# Altium schematic sheet Array-Sensors.SchDoc
size 420 x 297 mm; SheetNumber: 1; SheetTotal: 1
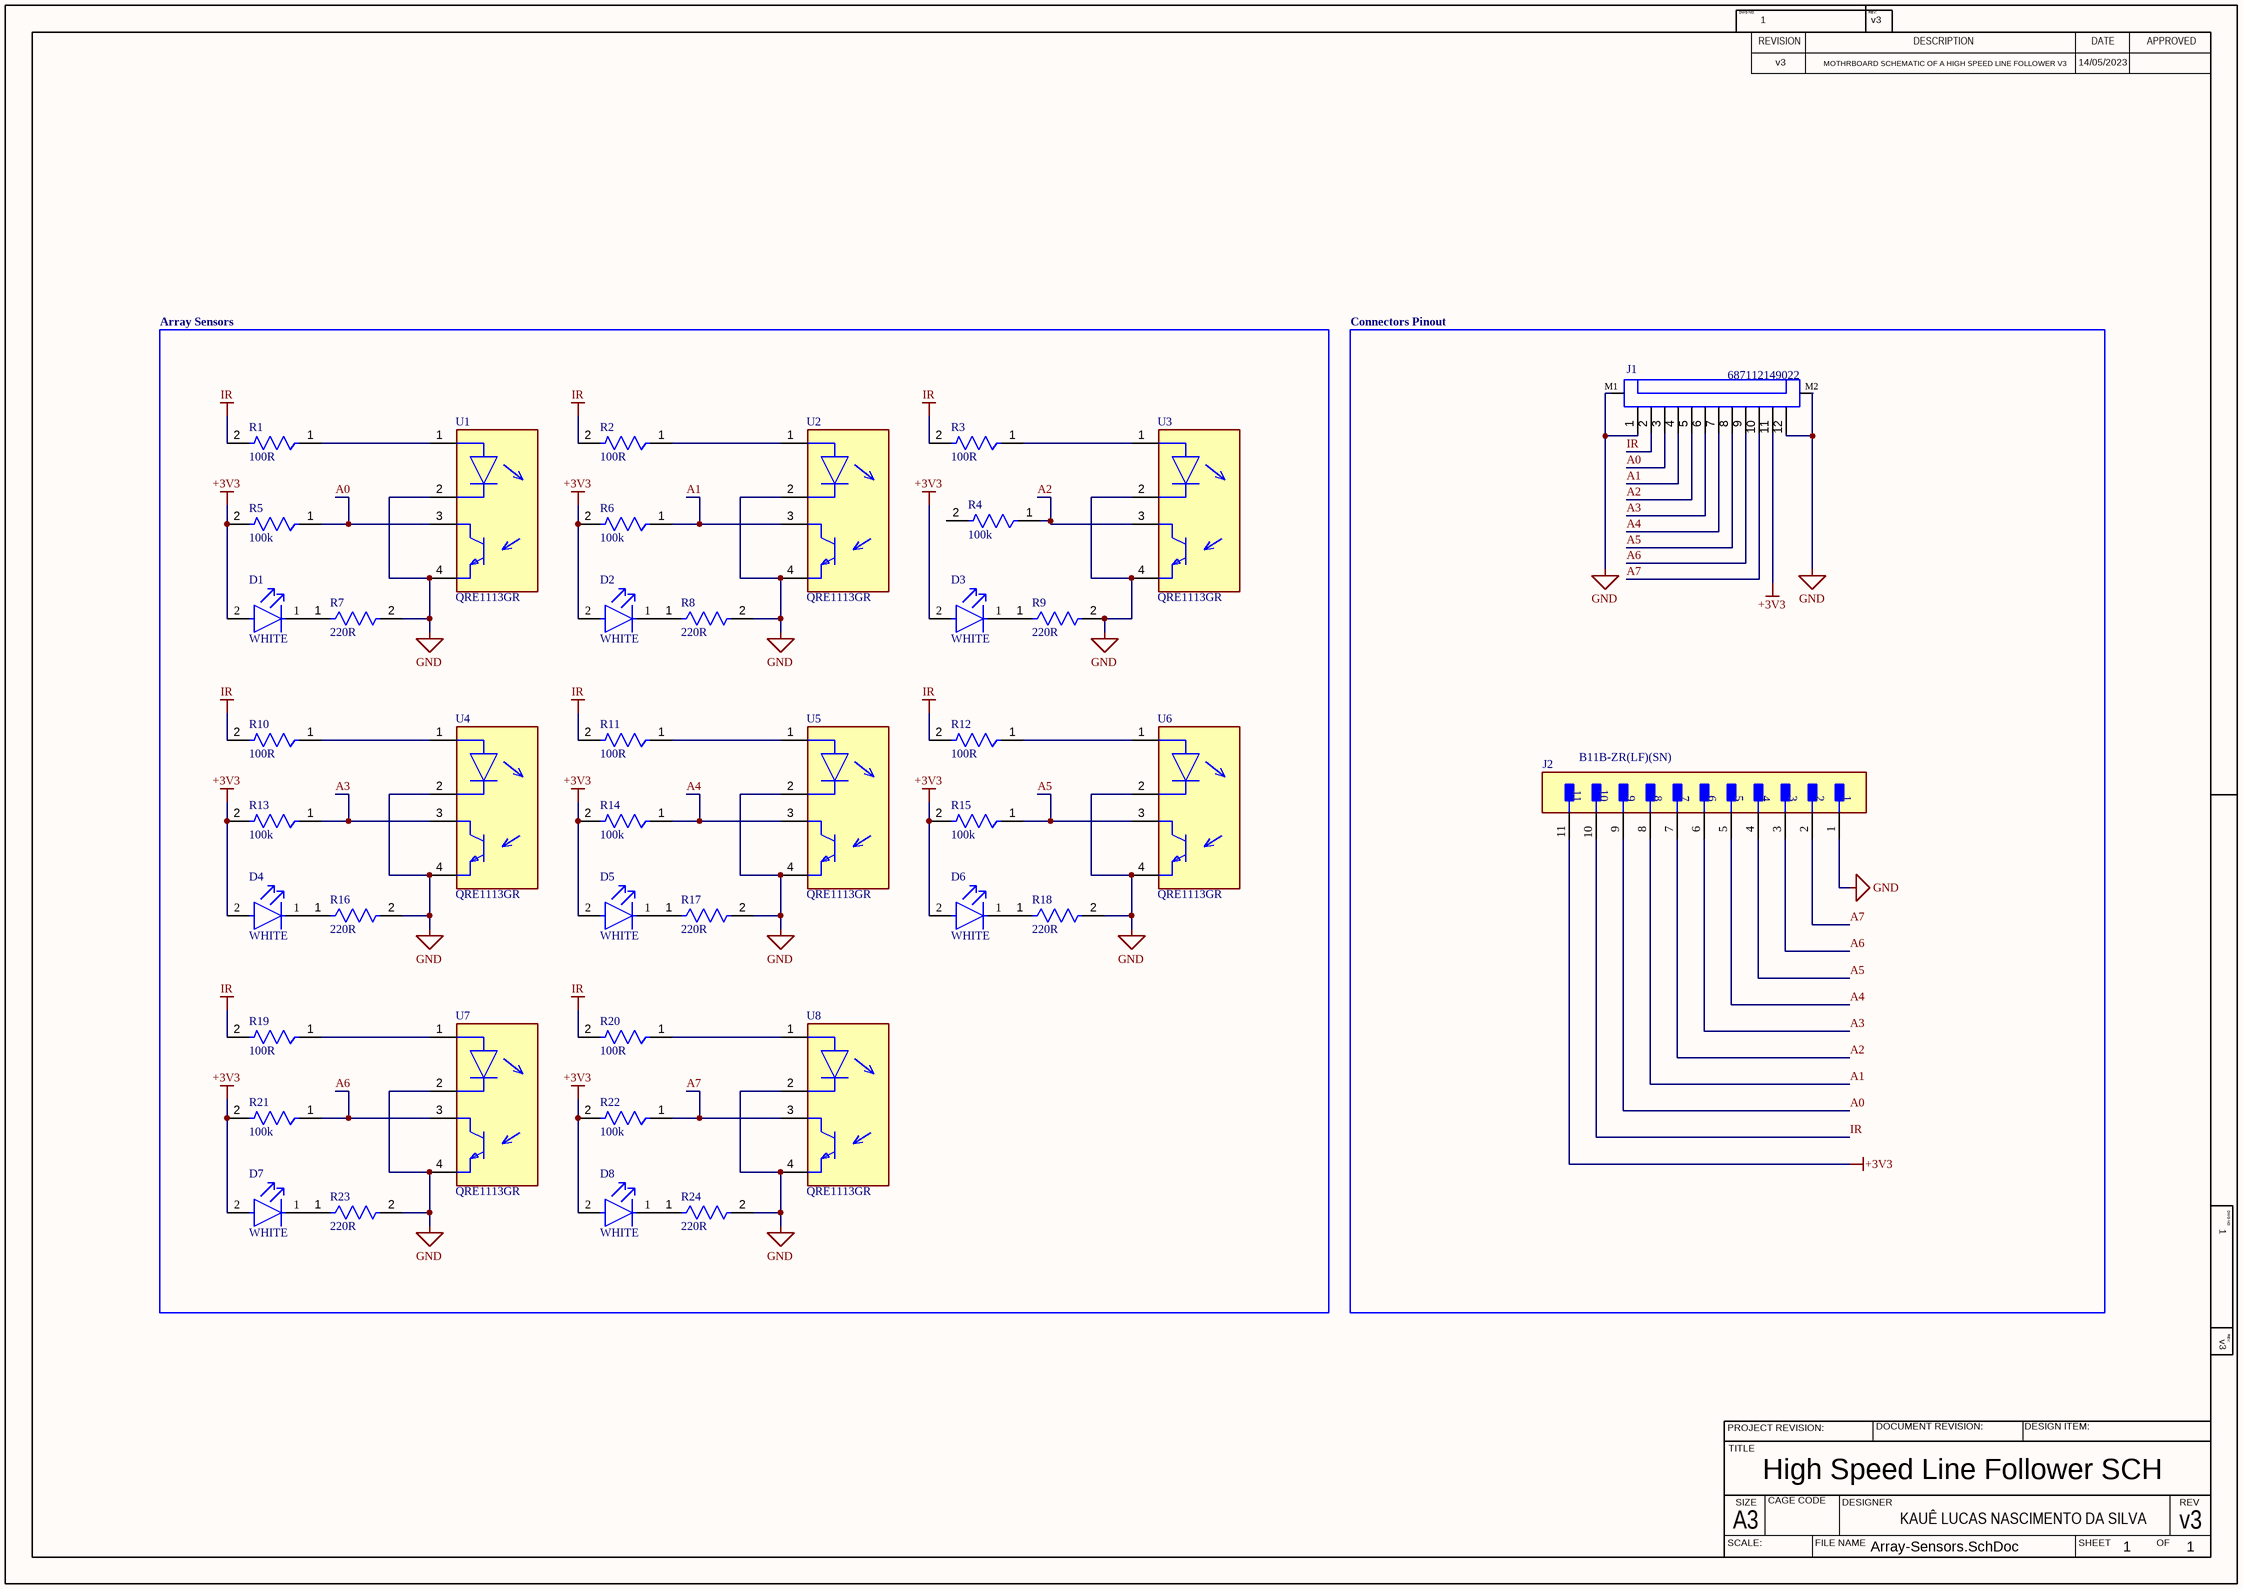
[diagram p0: Array-Sensors.SchDoc]

## Parts
D1  WHITE  [FP-SML-LX0805UWC-TR-MFG]
D2  WHITE  [FP-SML-LX0805UWC-TR-MFG]
D3  WHITE  [FP-SML-LX0805UWC-TR-MFG]
D4  WHITE  [FP-SML-LX0805UWC-TR-MFG]
D5  WHITE  [FP-SML-LX0805UWC-TR-MFG]
D6  WHITE  [FP-SML-LX0805UWC-TR-MFG]
D7  WHITE  [FP-SML-LX0805UWC-TR-MFG]
D8  WHITE  [FP-SML-LX0805UWC-TR-MFG]
J1  687112149022  [687112149022]
J2  B11B-ZR(LF)(SN)  [FP-B11B-ZR_LF_SN-MFG]
R1  100R  [FP-AF0805-IPC_A]
R2  100R  [FP-AF0805-IPC_A]
R3  100R  [FP-AF0805-IPC_A]
R4  100k  [FP-CRCW0805-HPe3-MFG]
R5  100k  [FP-CRCW0805-HPe3-MFG]
R6  100k  [FP-CRCW0805-HPe3-MFG]
R7  220R  [FP-AC0805-MFG]
R8  220R  [FP-AC0805-MFG]
R9  220R  [FP-AC0805-MFG]
R10  100R  [FP-AF0805-IPC_A]
R11  100R  [FP-AF0805-IPC_A]
R12  100R  [FP-AF0805-IPC_A]
R13  100k  [FP-CRCW0805-HPe3-MFG]
R14  100k  [FP-CRCW0805-HPe3-MFG]
R15  100k  [FP-CRCW0805-HPe3-MFG]
R16  220R  [FP-AC0805-MFG]
R17  220R  [FP-AC0805-MFG]
R18  220R  [FP-AC0805-MFG]
R19  100R  [FP-AF0805-IPC_A]
R20  100R  [FP-AF0805-IPC_A]
R21  100k  [FP-CRCW0805-HPe3-MFG]
R22  100k  [FP-CRCW0805-HPe3-MFG]
R23  220R  [FP-AC0805-MFG]
R24  220R  [FP-AC0805-MFG]
U1  QRE1113GR  [FP-100CY-MFG]
U2  QRE1113GR  [FP-100CY-MFG]
U3  QRE1113GR  [FP-100CY-MFG]
U4  QRE1113GR  [FP-100CY-MFG]
U5  QRE1113GR  [FP-100CY-MFG]
U6  QRE1113GR  [FP-100CY-MFG]
U7  QRE1113GR  [FP-100CY-MFG]
U8  QRE1113GR  [FP-100CY-MFG]

## Blocks framed on the sheet
Array Sensors: D1-D8 R1-R24 U1-U8
Connectors Pinout: J1 J2

## Nets
+3V3: D1.2(A) D2.2(A) D3.2(A) D4.2(A) D5.2(A) D6.2(A) D7.2(A) D8.2(A) J1.11 J2.11 R5.2 R6.2 R13.2 R14.2 R15.2 R21.2 R22.2
GND: J1.1 J1.12 J1.M1 J1.M2 J2.1 R7.2 R8.2 R9.2 R16.2 R17.2 R18.2 R23.2 R24.2 U1.2(C) U1.4(E) U2.2(C) U2.4(E) U3.2(C) U3.4(E) U4.2(C) U4.4(E) U5.2(C) U5.4(E) U6.2(C) U6.4(E) U7.2(C) U7.4(E) U8.2(C) U8.4(E)
IR: J1.2 J2.10 R1.2 R2.2 R3.2 R10.2 R11.2 R12.2 R19.2 R20.2
A0: J1.3 J2.9 R5.1 U1.3(C)
A1: J1.4 J2.8 R6.1 U2.3(C)
A2: J1.5 J2.7 R4.1 U3.3(C)
A3: J1.6 J2.6 R13.1 U4.3(C)
A4: J1.7 J2.5 R14.1 U5.3(C)
A5: J1.8 J2.4 R15.1 U6.3(C)
A6: J1.9 J2.3 R21.1 U7.3(C)
A7: J1.10 J2.2 R22.1 U8.3(C)
NetD1_1: D1.1(C) R7.1
NetD2_1: D2.1(C) R8.1
NetD3_1: D3.1(C) R9.1
NetD4_1: D4.1(C) R16.1
NetD5_1: D5.1(C) R17.1
NetD6_1: D6.1(C) R18.1
NetD7_1: D7.1(C) R23.1
NetD8_1: D8.1(C) R24.1
NetR1_1: R1.1 U1.1(A)
NetR2_1: R2.1 U2.1(A)
NetR3_1: R3.1 U3.1(A)
NetR10_1: R10.1 U4.1(A)
NetR11_1: R11.1 U5.1(A)
NetR12_1: R12.1 U6.1(A)
NetR19_1: R19.1 U7.1(A)
NetR20_1: R20.1 U8.1(A)

Not connected (* = marked no-connect by the designer): R4 2

## Notes on the sheet
- DWG NO:
- REVISION
- 1
- REV:
- v3
- DESCRIPTION
- DATE
- APPROVED
- MOTHRBOARD SCHEMATIC OF A HIGH SPEED LINE FOLLOWER V3
- 14/05/2023
- PROJECT REVISION:
- TITLE
- DOCUMENT REVISION:
- DESIGN ITEM:
- SCALE:
- A3
- SIZE
- High Speed Line Follower SCH
- CAGE CODE
- FILE NAME
- DESIGNER
- KAUÊ LUCAS NASCIMENTO DA SILVA
- SHEET
- OF
- REV

## Library data of the parts
D1-D8 = CMP-00229-00139794-1: SML-LX0805UWC-TR White LED, 0805 Diffused, Rectangle Lens SMD package; NexarPartId: 139794; Approvals: CSA, UL; Lens Color: Clear, Yellow; Luminous Intensity: 150mcd; Power Rating: 120mW; Forward Current: 20mA; Forward Voltage: 3.5V; Number of LEDs: 1; Viewing Angle: 120°; RoHS: Compliant; Case/Package: 0805; Illumination Color: White; Min Operating Temperature: -40°C; Mount: Surface Mount; Max Operating Temperature: 85°C
J1 = CMP-1502-01626-3: FFC/FPC Connector, 12 Contact(s), 1 Row(s), Female, Right Angle, Surface Mount Terminal; Pitch: 500µm; Operating Supply Voltage: 50V; Current Rating: 500mA; Insulation Resistance: 500MΩ; Wire/Cable Type: Straight; Contact Resistance: 50mΩ; Gender: Receptacle; Number of Contacts: 12; Actuator Material: Nylon, Polyamide; Max Operating Temperature: 105°C; Contact Plating: Tin; Mount: Surface Mount; RoHS: Compliant; Number of Pins: 12; Length: 6.6mm; Min Operating Temperature: -40°C; Lead Pitch: 500µm; Packaging: Tape and Reel; Voltage Rating: 50V; Number of Rows: 1; Contact Material: Bronze; Termination: Solder; Flammability Rating: UL94 V-0; Number of Positions: 12; REACH SVHC: Unknown; Orientation: Horizontal
J2 = CMP-00504-00248830-1: B11B-ZR(LF)(SN) Wire-To-Board Connector, Zh Series, Press Fit, Header, 11, 1.5 Mm, Tin Plated Contacts; NexarPartId: 248830; Pitch: 1.4986mm; Current Rating: 700mA; Connector Type: Male Pin; Number of Contacts: 11; Voltage Rating: 50V; Gender: Male; Number of Rows: 1; Contact Plating: Tin; Housing Color: Natural; Lead Free: Lead Free; Max Operating Temperature: 85°C; Contact Mating Length: 2.3876mm; Fastening Type: Detent; RoHS: Compliant; Termination: Press-Fit; Height: 4.5mm; Contact Material: Brass, Tin; Color: Natural; Packaging: Bulk; Mount: Through Hole; Housing Material: Nylon; Number of Positions: 11; Min Operating Temperature: -25°C; Lead Pitch: 1.5mm
R1-R3 R10-R12 R19 R20 = CMP-03412-047342-1: Anti-Sulfurated Chip Resistor Automotive Grade 100Ω 5% 0.125W ±100ppm/°C 0805; Max Power Dissipation: 125mW; Tolerance: 5%; Min Operating Temperature: -55°C; Packaging: Tape and Reel; Number of Terminations: 2; Resistance: 100R; Height: 0.024inch; Resistor Type: Thick Film; Features: Moisture Resistant; Max Operating Temperature: 155°C; Temperature Coefficient: 100ppm/°C; Series: AF; Length: 0.079inch; Case/Package: 0805; RoHS Compliant: Yes; Width: 0.049inch
R4-R6 R13-R15 R21 R22 = CMP-02407-010180-1: RES Thick Film, 100kΩ, 5%, 0.5W, 200ppm/°C, 0805; Max Power Dissipation: 333mW; Power Rating: 330mW; Voltage Rating: 150V; Resistance: 100kR; Case/Package: 0805; Max Operating Temperature: 155°C; Min Operating Temperature: -55°C; Tolerance: 5%; Package Quantity: 1; Number of Terminations: 2; Radiation Hardening: No; Width: 0.049inch; Composition: Thick Film; Mount: Surface Mount; Contact Plating: Tin; Case Code (Imperial): 0805; Length: 2mm; Lead Free: Lead Free; Height: 0.02inch; Features: Automotive AEC-Q200; Packaging: Tape and Reel; Temperature Coefficient: 200ppm/°C; Weight: 0.000194oz; Termination: SMD/SMT; Case Code (Metric): 2012
R7-R9 R16-R18 R23 R24 = CMP-03412-037443-1: RES SMD 220 OHM 5% 1/8W 0805; Manufacturer: Yageo; Manufacturer Part Number: AC0805JR-07220RL; Resistance: 220Ω; Tolerance: 0.05; Automotive Grade: Grade 0; Voltage Rating: 150V; Value: 220Ω; RoHS: TRUE; Octopart: https://octopart.com/ac0805jr-07220rl-yageo-30510975; ComponentLink2Description: Datasheet; Device Class L3: Chip SMD Resistors; Height: 0.6mm; Series: AC; Category: Res; Mouser Description: Res Thick Film 0805 220 Ohm 5% 1/8W ±100ppm/°C Molded SMD Paper T/R; Lead Free: Yes; Temperature Range High: +155°C; Ipc Land Pattern Name: RESC200125X50; Footprint Url: http://www.yageo.com/exep/pages/download/literatures/PYu-R_Mount_10.pdf; Device Class L2: Resistors; Power Rating: 1/8W; Automotive: Yes; Package: AC0805; Temperature Range Low: -55°C; Digikey Description: RES SMD 220 OHM 5% 1/8W 0805; Device Class L1: Passive Components; Temperature: -55°C to +155°C; ComponentLink2URL: http://www.yageo.com/documents/recent/PYu-AC_51_RoHS_L_6.pdf; Composition: Thick Film
U1-U8 = CMP-2000-06919-2: SENSOR OPTO TRANS REFL SMD PHOTO; Wavelength: 940nm; Fall Time: 20us; Forward Current: 50mA; Max Power Dissipation: 75mW; Operating Supply Voltage: 1.7V; Reverse Voltage (DC): 5V; Max Breakdown Voltage: 30V; Forward Voltage: 1.2V; Output Type: Phototransistor; Number of Elements: 1; Sensing Distance: 0.197inch; Max Collector Current: 20mA; Contact Plating: Tin; Packaging: Tape and Reel; Rise Time: 20us; Response Time: 20us; Case/Package: SMD/SMT; REACH SVHC: No SVHC; Lead Free: Lead Free; Width: 2.9mm; Package Quantity: 1000; Mount: Surface Mount; Input Current: 50mA; Max Operating Temperature: 85°C; Weight: 0.078g; Power Dissipation: 75mW; Reverse Breakdown Voltage: 5V; Collector Emitter Voltage (VCEO): 30V; Collector Emitter Breakdown Voltage: 30V; Number of Pins: 4; Min Operating Temperature: -40°C; Radiation Hardening: No; Height: 1.7mm; Number of Channels: 1; Length: 3.6mm